# EAGLE design BlueNRG (EAGLE 9.3.0)
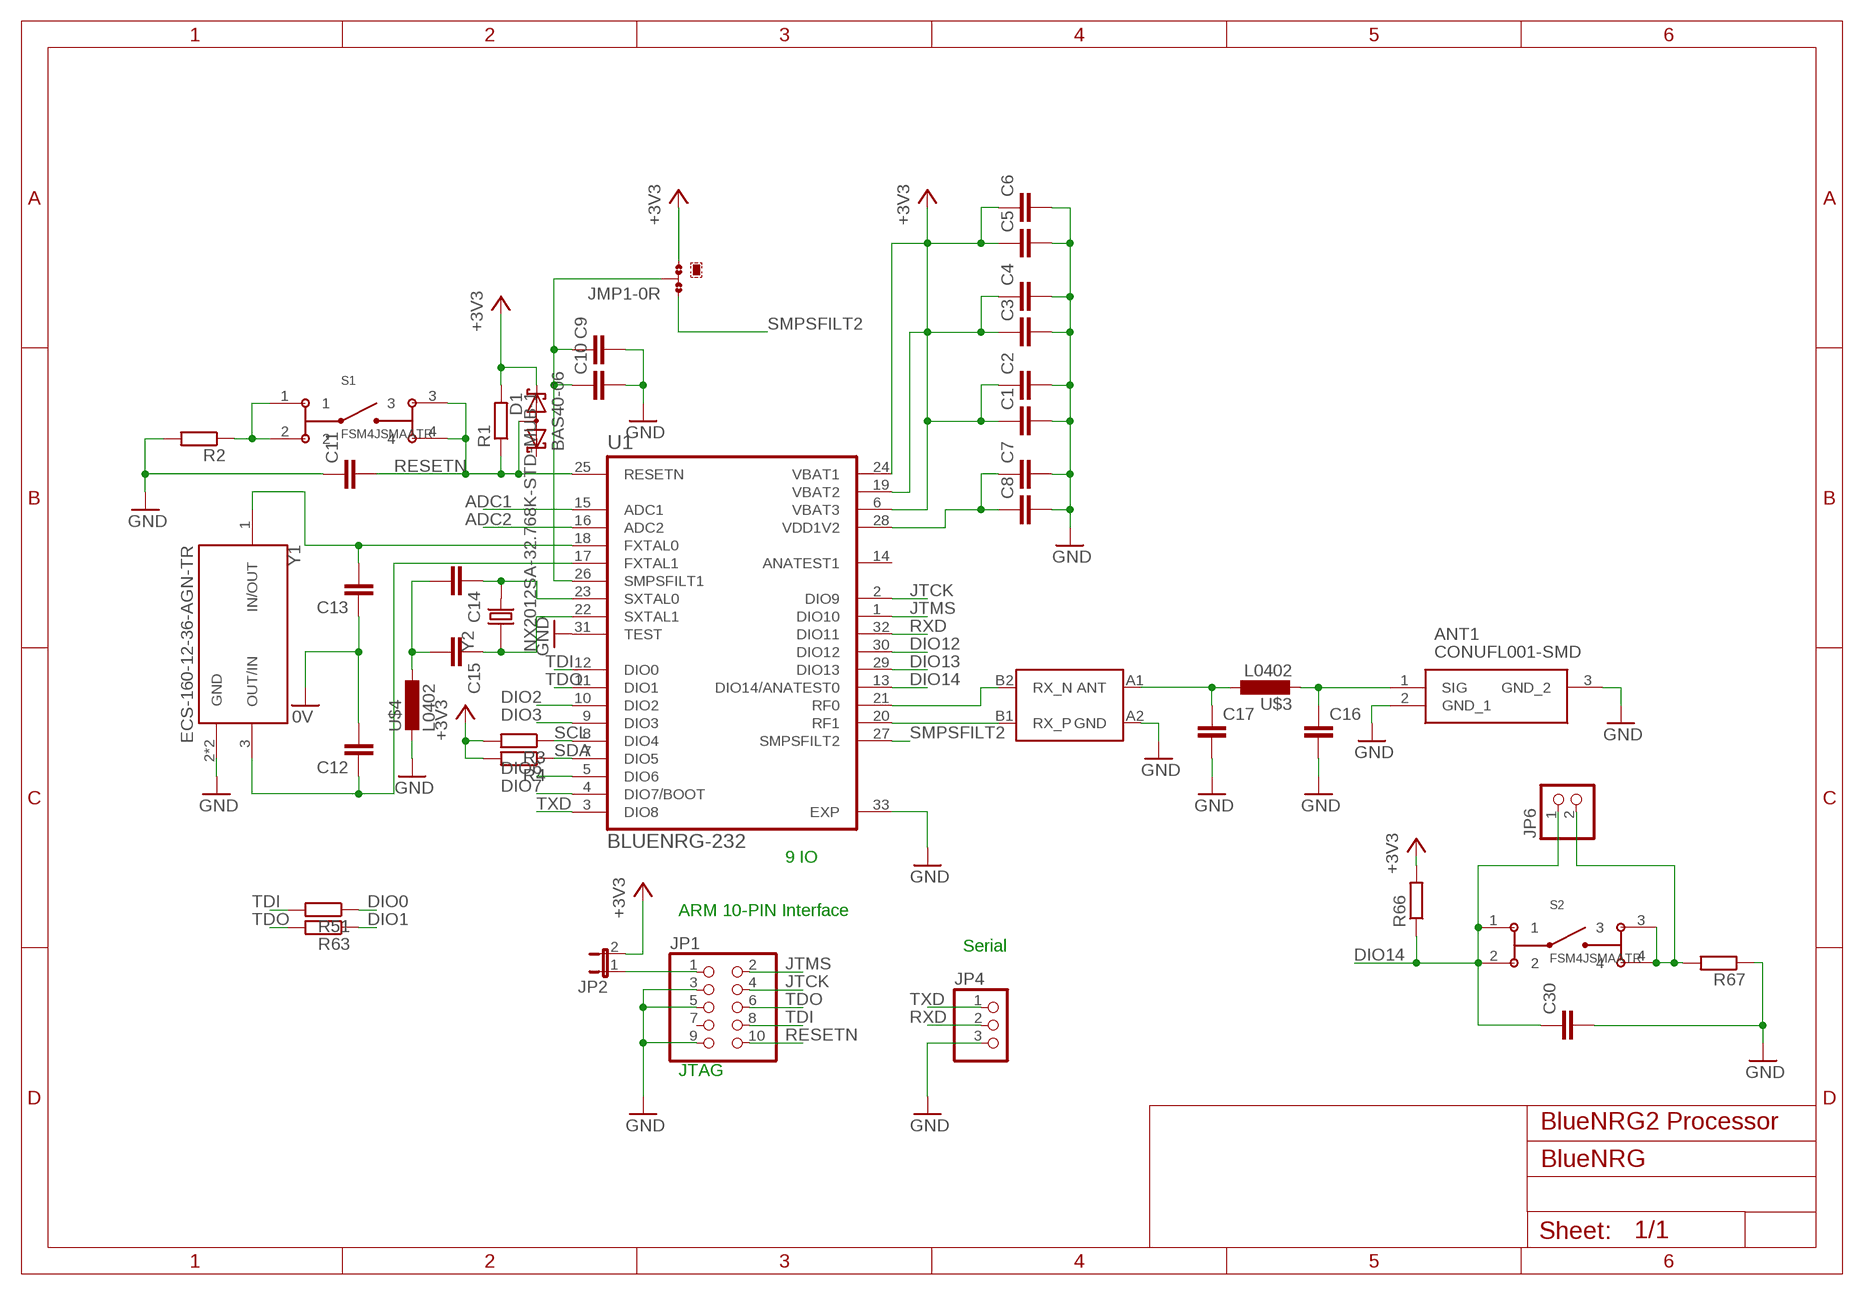
[diagram p0: schematic, sheet 1]

## Parts
ANT1  CONUFL001-SMD  [CONUFL001-SMD]
C1  C-EUC0805K  [C0805K]
C2  C-EUC0805K  [C0805K]
C3  C-EUC0805K  [C0805K]
C4  C-EUC0805K  [C0805K]
C5  C-EUC0805K  [C0805K]
C6  C-EUC0805K  [C0805K]
C7  C-EUC0805K  [C0805K]
C8  C-EUC0805K  [C0805K]
C9  C-EUC0805K  [C0805K]
C10  C-EUC0805K  [C0805K]
C11  C-EUC0805  [C0805]
C12  C-EUC0805  [C0805]
C13  C-EUC0805  [C0805]
C14  C-EUC0805  [C0805]
C15  C-EUC0805  [C0805]
C16  C-EUC0402  [C0402]
C17  C-EUC0402  [C0402]
C30  C-EUC0805  [C0805]
D1  BAS40-06  [SOT23]
JMP1  0R-JUMPA  [A0R-JMP]
JP1  PINHD-2X5  [2X05]
JP2  JP1E  [JP1]
JP4  PINHD-1X3  [1X03]
JP6  PINHD-1X2  [1X02]
R1  R-EU_R0805  [R0805]
R2  R-EU_R0805  [R0805]
R3  R-EU_R0805  [R0805]
R4  R-EU_R0805  [R0805]
R51  R-EU_R0805  [R0805]
R63  R-EU_R0805  [R0805]
R66  R-EU_R1210  [R1210]
R67  R-EU_R1210  [R1210]
S1  FSM4JSMAATR  [SW_FSM4JSMAATR]
S2  FSM4JSMAATR  [SW_FSM4JSMAATR]
U1  BLUENRG-232  [QFN50P500X500X100-33T345N]
U$3  L0402  [R0402]
U$4  L0402  [R0402]
U$5  BALF-NRG-01D3  [FLIPCHIP]
Y1  ECS-160-12-36-AGN-TR  [XTAL_ECS-160-12-36-AGN-TR]
Y2  NX2012SA-32.768K-STD-MUB-1  [XTAL_NX2012SA-32.768K-STD-MUB-1]

## Nets
0V: C12.2 C13.1
+3V3: C1.1 C2.1 C3.1 C4.1 C5.1 C6.1 D1.2(K2) JMP1.3 JP2.2 R1.2 R3.2 R4.2 R66.2 U1.6(VBAT3) U1.19(VBAT2) U1.24(VBAT1)
ADC1: U1.15(ADC1)
ADC2: U1.16(ADC2)
DIO0: R51.1
DIO1: R63.1
DIO2: U1.10(DIO2)
DIO3: U1.9(DIO3)
DIO6: U1.5(DIO6)
DIO7: U1.4(DIO7/BOOT)
DIO12: U1.30(DIO12)
DIO13: U1.29(DIO13)
DIO14: C30.1 JP6.1 R66.1 S2.1 S2.2 U1.13(DIO14/ANATEST0)
GND: ANT1.2(GND_1) ANT1.3(GND_2) C1.2 C2.2 C3.2 C4.2 C5.2 C6.2 C7.2 C8.2 C9.2 C10.2 C11.1 C16.2 C17.2 C30.2 JP1.3 JP1.5 JP1.9 JP4.3 R2.2 R67.1 U1.31(TEST) U1.33(EXP) U$4.2 U$5.A2(GND) Y1.2(GND) Y1.4(GND)
JTCK: JP1.4 U1.2(DIO9)
JTMS: JP1.2 U1.1(DIO10)
N$1: C7.1 C8.1 U1.28(VDD1V2)
N$2: C9.1 C10.1 JMP1.2 U1.26(SMPSFILT1)
N$3: JP1.1 JP2.1
N$4: C12.1 U1.17(FXTAL1) Y1.3(OUT/IN)
N$5: R2.1 S1.1 S1.2
N$6: C13.2 U1.18(FXTAL0) Y1.1(IN/OUT)
N$7: U1.21(RF0) U$5.B2(RX_N)
N$8: U1.20(RF1) U$5.B1(RX_P)
N$9: C14.2 C15.2 U$4.1
N$10: C14.1 U1.23(SXTAL0) Y2.2
N$11: C15.1 U1.22(SXTAL1) Y2.1
N$16: C17.1 U$3.1 U$5.A1(ANT)
N$17: ANT1.1(SIG) C16.1 U$3.2
N$114: JP6.2 R67.2 S2.3 S2.4
RESETN: C11.2 D1.3(AA) JP1.10 R1.1 S1.3 S1.4 U1.25(RESETN)
RXD: JP4.2 U1.32(DIO11)
SCL: R3.1 U1.8(DIO4)
SDA: R4.1 U1.7(DIO5)
SMPSFILT2: JMP1.1 U1.27(SMPSFILT2)
TDI: JP1.8 R51.2 U1.12(DIO0)
TDO: JP1.6 R63.2 U1.11(DIO1)
TXD: JP4.1 U1.3(DIO8)
Unconnected: D1.1(K1) JP1.7 U1.14(ANATEST1)

## Notes on the sheet
- 9 IO
- ARM 10-PIN Interface
- Serial
- JTAG
- BlueNRG2 Processor

## Library data of the parts
ANT1 = BlueHome:CONUFL001-SMD: RF Connectors / Coaxial Connectors U.FL Straight Surface Mount Jack Source: Datasheet <https://componentsearchengine.com/Datasheets/1/CONUFL001-SMD.pdf>; DESCRIPTION: RF Connectors / Coaxial Connectors U.FL Straight Surface Mount Jack; HEIGHT: mm; MANUFACTURER_NAME: Linx Technologies; MANUFACTURER_PART_NUMBER: CONUFL001-SMD; MOUSER_PART_NUMBER: 712-CONUFL001-SMD
C1-C17 C30 = rcl:C-EU: CAPACITOR, European symbol
D1 = diode:BAS40-06: Silicon Schottky Diodes General-purpose diode for high-speed switching
JMP1 = jump-0r-smd:0R-JUMP: SMD 0R 0805 Jumper
JP1 = pinhead:PINHD-2X5: PIN HEADER
JP2 = jumper:JP1E: JUMPER
JP4 = pinhead:PINHD-1X3: PIN HEADER
JP6 = pinhead:PINHD-1X2: PIN HEADER
R1-R4 R51 R63 R66 R67 = rcl:R-EU_: RESISTOR, European symbol
S1 S2 = BlueHome:FSM4JSMAATR: Switch Tactile OFF (ON) SPST Round Button Gull Wing 0.05A 24VDC 2.6N SMD T/R; AVAILABILITY: Unavailable; DESCRIPTION: Switch Tactile OFF _ON_ SPST Round Button Gull Wing 0.05A 24VDC 2.6N SMD T/R; MF: TE Connectivity; MP: FSM4JSMAATR; PACKAGE: None; PRICE: None; TE_PURCHASE_URL: https://www.te.com/usa-en/product-FSM4JSMAATR.html?te_bu=Cor&te_type=disp&te_campaign=seda_glo_cor-seda-global-disp-prtnr-fy19-seda-model-bom-cta_sma-317_1&elqCampaignId=32493
U1 = BlueHome:BLUENRG-232: Bluetooth Low Energy Wireless Soc; AVAILABILITY: Unavailable; DESCRIPTION: Bluetooth Low Energy Wireless Soc; MF: STMicroelectronics; MP: BLUENRG-232; PACKAGE: VFQFN-32 STMicroelectronics; PRICE: None
U$3 U$4 = BlueHome:L
U$5 = BlueHome:BALF-NRG-01D3; AVAILABILITY: Unavailable; DESCRIPTION: 50 Ω nominal input / conjugate match balun to BlueNRG transceiver, with integrated harmonic filter; MF: STMicroelectronics; MP: BALF-NRG-01D3; PACKAGE: WFBGA-4 STMicroelectronics; PRICE: None
Y1 = BlueHome:ECS-160-12-36-AGN-TR: The minature ECX-2236 is a compact SMD Crystal. The industry standard 2.5 x 2.0 x 0.55 mm ceramic package is ideal for today’s SMD manufacturing environment.; AVAILABILITY: Unavailable; DESCRIPTION: Crystal 16MHz ±25ppm _Tol_ ±30ppm _Stability_ 12pF FUND 80Ohm 4-Pin Mini-CSMD T/R; MF: ECS Inc.; MP: ECS-160-12-36-AGN-TR; PACKAGE: SMD-4 ECS International; PRICE: None
Y2 = BlueHome:NX2012SA-32.768K-STD-MUB-1: Crystal 32.7680khz 12.5pf Smd; AVAILABILITY: Unavailable; DESCRIPTION: Crystal 32.7680khz 12.5pf Smd; MF: NDK America,; MP: NX2012SA-32.768K-STD-MUB-1; PACKAGE: SMD-2 NDK; PRICE: None

## Board
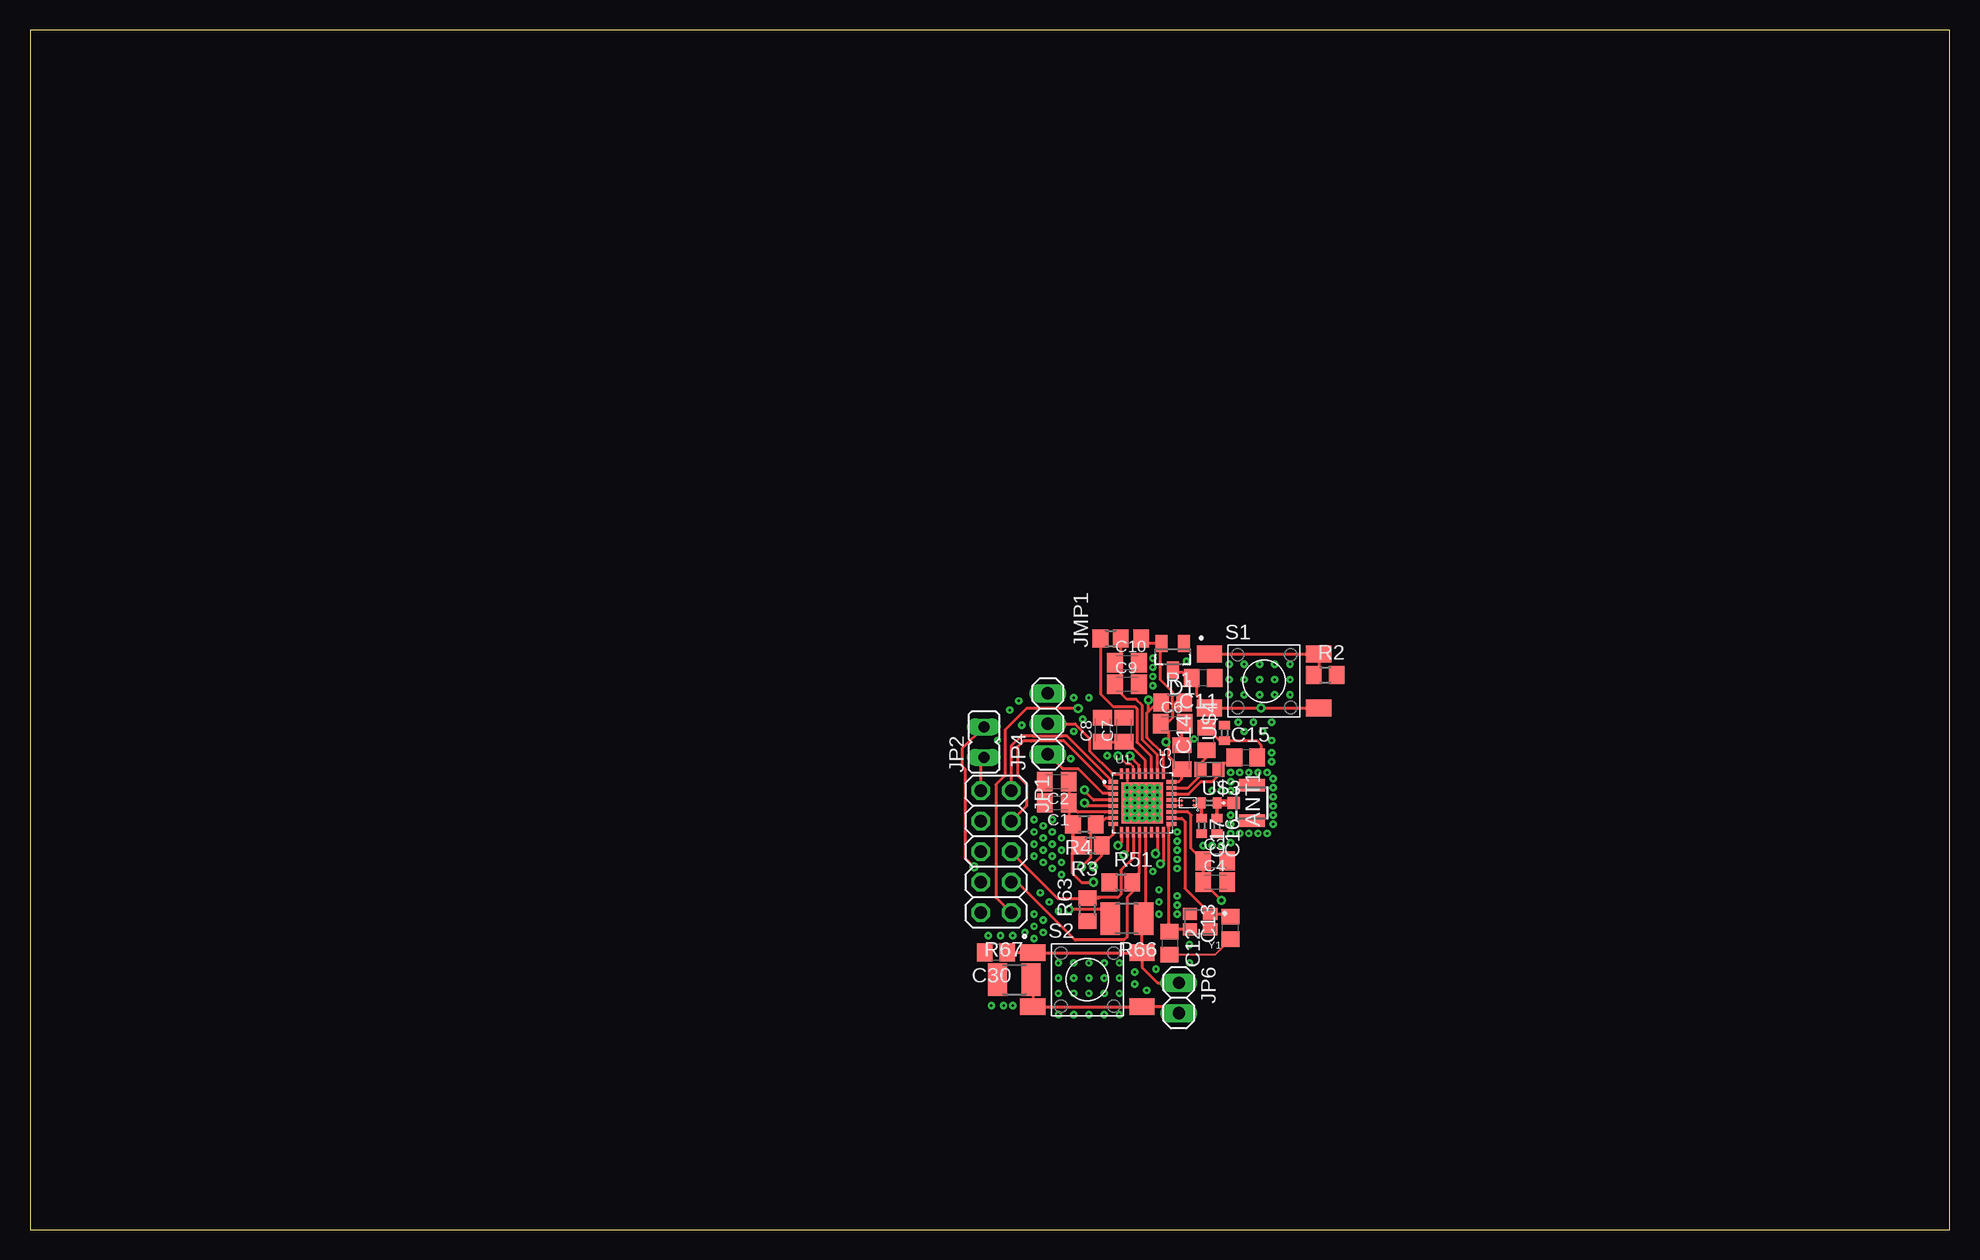
[diagram p1: board, top side]
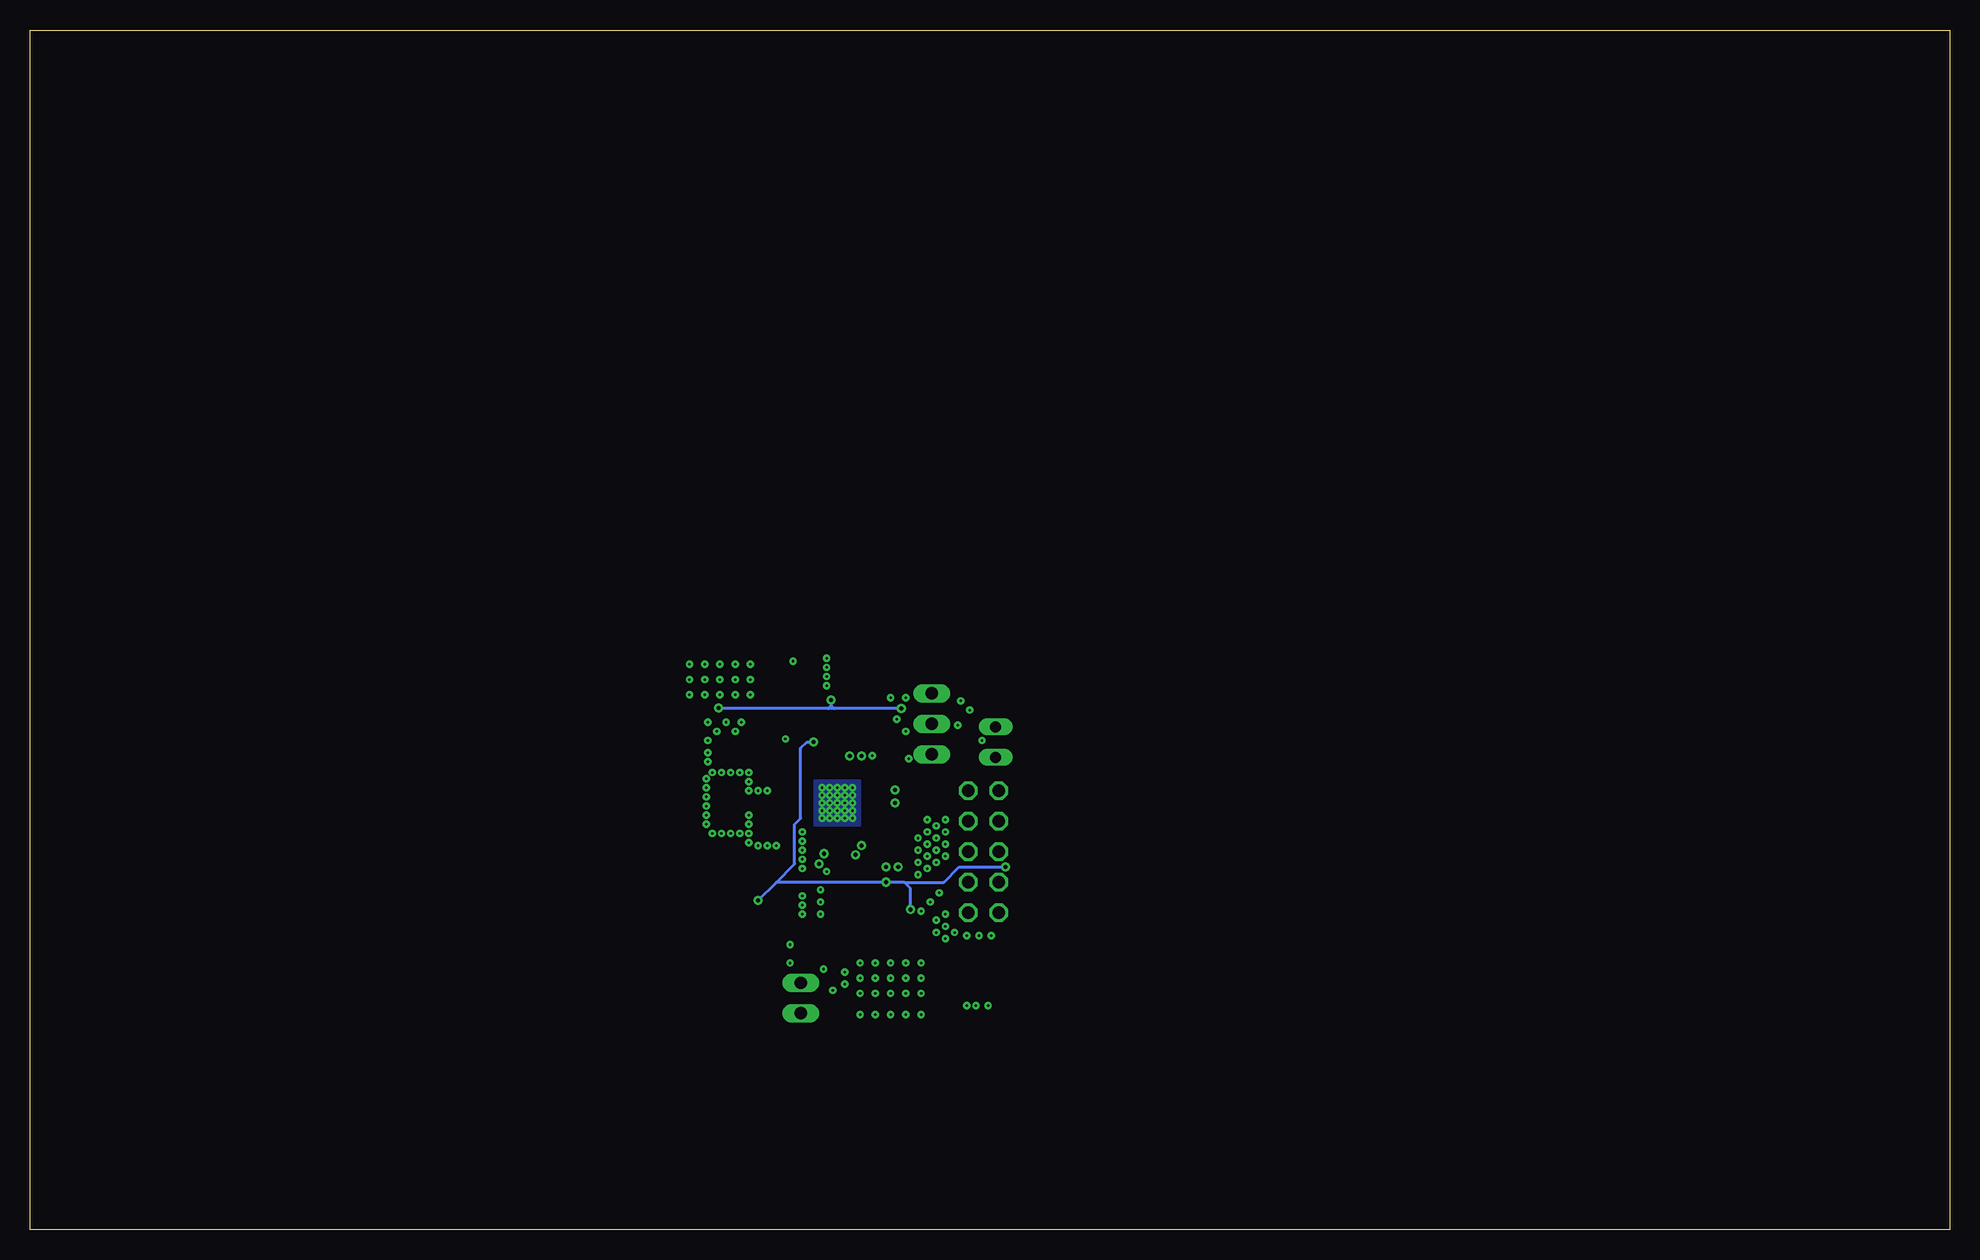
[diagram p2: board, bottom side, seen from below]

Size 160 x 100 mm. Coordinates in mm from the lower left corner, seen from the top.
Outline: 0,0 160,0 160,100 0,100 0,0
Copper layers (1*16): Top 0.035mm / dielectric 1.5mm / Bottom 0.035mm
Design rules "default": minimum track width 6mil, minimum drill 0.35mm, track to track 6mil, track to pad 6mil, pad to pad 6mil, via to via 6mil, smd to smd 6mil, copper to edge 40mil, drill to drill 6mil, minimum pad ring 10mil, minimum via ring 8mil, stop-mask expansion 4mil, vias tented up to drill 0mil, thermal gap 10mil

### Footprints (pad centres in the part's own frame; a part is rotated, then mirrored left to right if it is on the bottom)
CONUFL001-SMD = smd 1 x 1.05: 1 0,-1.525 | smd 1.05 x 2.2: 2 -1.475,0; 3 1.475,0
C0805K = smd 1.3 x 1.6: 1 -1,0; 2 1,0
C0805 = smd 1.3 x 1.5: 1 -0.95,0; 2 0.95,0
C0402 = smd 0.7 x 0.9: 1 -0.65,0; 2 0.65,0
SOT23 = smd 1 x 1.4: 1 -0.95,-1.1; 2 0.95,-1.1; 3 0,1.1
A0R-JMP = smd 1.5 x 1.3: 1 0,1.7; 2 0,0; 3 0,-1.7
2X05 = drill 1.016 octagon: 1 -5.08,-1.27; 2 -5.08,1.27; 3 -2.54,-1.27; 4 -2.54,1.27; 5 0,-1.27; 6 0,1.27; 7 2.54,-1.27; 8 2.54,1.27; 9 5.08,-1.27; 10 5.08,1.27
JP1 = drill 0.914 long: 1 0,-1.27; 2 0,1.27
1X03 = drill 1.016 long: 1 -2.54,0; 2 0,0; 3 2.54,0
1X02 = drill 1.016 long: 1 -1.27,0; 2 1.27,0
R0805 = smd 1.3 x 1.5: 1 -0.95,0; 2 0.95,0
R1210 = smd 1.6 x 2.7: 1 -1.4,0; 2 1.4,0
SW_FSM4JSMAATR = smd 2.1 x 1.4: 1 -4.55,2.25; 2 4.55,2.25; 3 -4.55,-2.25; 4 4.55,-2.25
QFN50P500X500X100-33T345N = smd 0.84 x 0.29: 1 -2.435,1.75; 2 -2.435,1.25; 3 -2.435,0.75; 4 -2.435,0.25; 5 -2.435,-0.25; 6 -2.435,-0.75; 7 -2.435,-1.25; 8 -2.435,-1.75; 17 2.435,-1.75; 18 2.435,-1.25; 19 2.435,-0.75; 20 2.435,-0.25; 21 2.435,0.25; 22 2.435,0.75; 23 2.435,1.25; 24 2.435,1.75 | smd 0.29 x 0.84: 9 -1.75,-2.435; 10 -1.25,-2.435; 11 -0.75,-2.435; 12 -0.25,-2.435; 13 0.25,-2.435; 14 0.75,-2.435; 15 1.25,-2.435; 16 1.75,-2.435; 25 1.75,2.435; 26 1.25,2.435; 27 0.75,2.435; 28 0.25,2.435; 29 -0.25,2.435; 30 -0.75,2.435; 31 -1.25,2.435; 32 -1.75,2.435 | smd 3.45 x 3.45: 33 0,0
R0402 = smd 0.7 x 0.9: 1 -0.65,0; 2 0.65,0
FLIPCHIP = smd 0.255 x 0.255: A1 -0.5,0.2; A2 -0.5,-0.2; B1 0.5,0.2; B2 0.5,-0.2
XTAL_ECS-160-12-36-AGN-TR = smd 1.2 x 1: 1 -0.85,-0.65; 2 0.85,-0.65; 3 0.85,0.65; 4 -0.85,0.65
XTAL_NX2012SA-32.768K-STD-MUB-1 = smd 1 x 1.25: 1 -0.75,0; 2 0.75,0

### Placement (x,y rotation side)
ANT1  101.85,35.56 270 top
C1  85.6,35.56 180 top
C2  85.6,37.34 180 top
C3  98.81,30.73 0 top
C4  98.81,28.96 0 top
C5  96.01,39.37 90 top
C6  95.25,42.16 0 top
C7  91.19,41.66 90 top
C8  89.41,41.66 90 top
C9  91.44,45.47 0 top
C10  91.44,47.24 0 top
C11  97.79,45.97 180 top
C12  95,23.88 270 top
C13  100.08,25.15 90 top
C14  98.04,40.89 90 top
C15  101.35,39.37 0 top
C16  98.93,33.66 270 top
C17  97.66,33.66 270 top
C30  80.52,23.11 180 top
D1  95.25,47.75 180 top
JMP1  90.93,49.28 90 top
JP1  80.52,31.5 270 top
JP2  79.5,40.64 0 top
JP4  84.84,42.16 90 top
JP6  95.76,19.3 270 top
R1  95.25,43.94 0 top
R2  107.95,46.23 0 top
R3  88.39,32 180 top
R4  87.88,33.78 180 top
R51  90.93,28.96 0 top
R63  88.14,26.67 90 top
R66  91.44,25.91 180 top
R67  82.04,20.83 0 top
S1  102.87,45.72 0 top
S2  88.14,20.83 0 top
U1  92.71,35.56 0 top
U$3  98.3,35.56 0 top
U$4  99.57,41.4 90 top
U$5  96.52,35.56 180 top
Y1  97.54,25.65 180 top
Y2  98.3,38.35 180 top

### Tracks (layer width: path | path; a pad name or v marks a point on that pad's centre or on a via)
0V
  Top 0.152: C13.1 98.81,22.93 C12.2
+3V3  (via drill 0.35 pad 0.2)
  Top 0.254: U1.19 96.51,34.81 96.77,34.54 96.77,31.77 C3.1 C4.1 99.31,27.45 v99.31,27.43 | U1.24 95.17,37.34 95.76,37.34 96.01,37.59 C5.1 96,38.37 94.93,39.43 94.93,40.64 | 94.93,40.64 94.93,41.48 C6.1 94.74,42.16 95.25,42.67 95.25,43.69 | 95.25,43.69 95.5,43.94 R1.2 | D1.2 94.23,48.85 | 94.23,48.85 93.06,48.85 JMP1.3 | U1.6 89.6,34.81 87.35,34.81 C1.1 C2.1 86.6,33.86 86.93,33.53 | v94.68,40.64 94.93,40.64 | R3.2 86.87,31.43 86.87,29.72 87.63,28.96 v88.65,28.96 | R66.2 89.28,26.67 v86.61,26.67 | JP2.2 77.72,40.13 77.72,38.61 77.98,38.35 77.98,30.94 v78.69,30.23 | 95.25,43.69 95.23,43.71 95.23,44.81 94.23,45.8 94.23,48.85
  Top 0.305: R4.2 86.93,33.53 86.93,32.51 R3.2
  Bottom 0.254: v99.31,27.43 97.79,28.96 | v94.68,40.64 95.25,40.64 95.76,40.13 95.76,34.29 96.27,33.78 96.27,30.48 97.79,28.96 | 97.79,28.96 v88.65,28.96 87.12,28.96 | v86.61,26.67 86.61,28.45 87.12,28.96 | 87.12,28.96 83.82,28.96 82.55,30.23 v78.69,30.23
ADC1  (via drill 0.35 pad 0.2)
  Top 0.254: U1.15 93.96,31.49 v93.8,31.33
ADC2  (via drill 0.35 pad 0.2)
  Top 0.254: U1.16 94.46,30.71 v94.23,30.48
DIO2  (via drill 0.35 pad 0.2)
  Top 0.254: U1.10 91.46,31.52 v91.19,31.24
DIO3  (via drill 0.35 pad 0.2)
  Top 0.254: U1.9 90.96,32.29 v90.68,32
DIO6  (via drill 0.35 pad 0.2)
  Top 0.254: U1.5 88.13,35.31 v87.88,35.56
DIO7  (via drill 0.35 pad 0.2)
  Top 0.254: U1.4 88.65,35.81 87.82,36.64 v87.88,36.64
DIO12  (via drill 0.35 pad 0.2)
  Top 0.203: 91.95,38.01 91.95,38.61 91.74,38.82 91.4,38.82 90.75,39.48 v90.68,39.48
  Top 0.254: U1.30 91.95,38.01
DIO13  (via drill 0.35 pad 0.2)
  Top 0.254: U1.29 92.46,38.69 v91.67,39.48
DIO14
  Top 0.254: U1.13 92.96,26.8 93.03,26.73 93.03,25.97 92.96,25.91 R66.1 92.69,25.76 S2.2 | C30.1 81.5,23.08 | 81.5,23.08 81.79,22.79 | 81.5,23.08 S2.1 S2.2 | S2.2 92.69,21.87 93.98,20.57 JP6.1
GND  (via drill 0.2 pad 0.2)
  Top 0.203: U1.31 91.46,36.85 v91.44,36.83 | C5.2 96.5,40.37 v97.03,40.89
  Top 0.254: C5.2 96.01,41.93 C6.2
  other vias: 92.08,36.83 92.71,36.83 93.34,36.83 93.98,36.83 91.44,36.2 92.08,36.2 92.71,36.2 93.34,36.2 93.98,36.2 91.44,35.56 92.08,35.56 92.71,35.56 93.34,35.56 93.98,35.56 91.44,34.92 92.08,34.92 92.71,34.92 93.34,34.92 93.98,34.92 91.44,34.29 92.08,34.29 92.71,34.29 93.34,34.29 93.98,34.29 100.08,36.58 99.31,36.58 98.55,36.58 100.08,37.34 100.08,34.54 100.08,33.78 100.84,33.02 100.08,33.02 101.6,33.02 102.36,33.02 103.12,33.02 103.63,34.54 103.63,33.78 103.63,35.31 103.63,36.07 103.63,36.83 103.63,37.59 103.12,38.1 102.36,38.1 101.6,38.1 100.84,38.1 100.08,38.1 100.08,32.26 99.31,32 98.55,32 97.79,32 95.63,33.15 95.63,32.38 95.63,31.62 95.63,30.86 95.63,30.1 95.63,27.81 95.63,27.05 95.63,26.29 83.69,34.16 83.69,33.15 83.69,32.13 83.69,31.11 84.45,33.66 84.45,32.64 84.45,31.62 84.45,30.61 85.22,31.11 85.22,32.13 85.22,33.15 85.22,34.16 85.98,32.64 85.98,31.62 85.98,30.61 85.22,30.1 85.98,29.59 84.2,28.07 84.96,27.3 85.72,26.54 83.69,26.29 83.69,25.27 84.45,25.78 84.45,24.77 83.69,24.26 82.93,24.77 81.92,24.51 80.9,24.51 79.88,24.51 85.72,22.23 85.72,20.95 85.72,19.68 87,19.68 88.27,19.68 90.81,19.68 89.53,19.68 87,20.95 87,22.23 88.27,22.23 89.53,22.23 88.27,20.95 89.53,20.95 90.81,20.95 90.81,22.23 92.08,21.46 92.08,20.45 93.09,19.94 94.11,26.29 94.11,27.3 94.11,28.32 93.6,29.84 96.65,23.75 96.65,22.23 93.85,21.72 85.72,17.91 87,17.91 88.27,17.91 89.53,17.91 90.81,17.91 86.74,39.24 87,41.53 89.79,39.5 87.76,42.55 82.68,42.04 80.64,40.77 81.66,43.31 82.42,44.07 87,44.32 88.27,44.32 93.6,45.34 93.6,46.86 93.6,46.1 93.6,47.62 96.39,47.37 99.95,47.12 99.95,45.85 99.95,44.58 101.22,44.58 102.49,44.58 103.76,44.58 105.03,44.58 105.03,45.85 105.03,47.12 103.76,47.12 102.49,47.12 101.22,47.12 101.22,45.85 102.49,45.85 103.76,45.85 100.71,42.29 101.22,41.53 101.98,42.29 102.74,41.53 103.5,42.29 103.5,40.77 103.5,39.75 103.5,38.99 80.14,18.67 81.15,18.67 81.92,18.67
  pour Bottom: 90.81,37.47 90.81,33.66 94.61,33.66 94.61,37.47
JTCK
  Top 0.254: 89.83,36.81 U1.2 90.2,36.89 89.75,36.89 89.58,37.06 89.58,37.34 86.2,40.72 83.47,40.72 83.45,40.74 82.8,40.74 82.3,40.23 82.3,37.85 83.06,37.08 83.06,35.31 JP1.4
JTMS
  Top 0.254: U1.1 86.44,41.15 86.06,41.15 86.03,41.12 83.64,41.12 83.62,41.15 82.64,41.15 81.79,40.3 JP1.2
N$1
  Top 0.254: C8.1 C7.1 91.42,40.66 92.96,39.12 U1.28
N$2
  Top 0.254: U1.26 93.96,39.58 92.71,40.83 92.71,43.69 92.2,44.2 91.44,44.2 90.93,44.7 90.93,45.47 | 90.93,45.47 90.93,47.24 | 90.93,47.24 JMP1.2 | C10.1 90.93,47.24 | C9.1 90.93,45.47
N$3
  Top 0.254: JP2.1 79.25,39.12 JP1.1
N$4
  Top 0.254: 96.54,25.15 Y1.3 94.89,25 | U1.17 94.89,33.56 94.89,25 | 94.89,25 94.89,24.93 C12.1
N$5
  Top 0.254: S1.1 S1.2 107.42,46.65 R2.1
N$6
  Top 0.254: U1.18 95.17,34.29 96.01,34.29 96.27,34.04 96.27,28.45 98.39,26.33 Y1.1 100.08,26.3 C13.2
N$7
  Top 0.152: U1.21 95.19,35.76 U$5.B2
N$8
  Top 0.152: U1.20 95.19,35.36 U$5.B1
N$9
  Top 0.254: C15.2 102.62,39.69 102.62,40.39 102.25,40.75 U$4.1 99.14,40.75 C14.2
N$10
  Top 0.254: U1.23 96.5,36.81 97.55,37.86 Y2.2 97.55,38.87 98.04,39.37 C14.1
N$11
  Top 0.254: 95.16,36.32 U1.22 96.58,36.31 97.6,37.34 98.55,37.34 99.05,37.83 Y2.1 99.05,38.85 99.06,38.86 99.89,38.86 C15.1
N$16
  Top 0.254: U$5.A1 97.28,35.36 | 97.28,35.36 97.61,35.36 97.66,35.31 | U$3.1 97.48,35.56 97.28,35.36
  Top 0.305: U$3.1 97.66,35.55 97.66,35.31 C17.1
N$17
  Top 0.305: U$3.2 98.95,34.32 C16.1
  Top 0.61: U$3.2 ANT1.1
N$114
  Top 0.254: R67.2 83.59,20.68 S2.3 S2.4 95.21,18.58 JP6.2
RESETN  (via drill 0.35 pad 0.2)
  Top 0.254: S1.4 v102.62,43.47 S1.3 97.28,44.51 97.28,45.53 C11.2 96.52,45.97 96.05,46.44 95.04,46.44 D1.3 | R1.1 93.98,43.94 93.22,43.18 | 93.22,43.18 93.12,43.09 93.12,40.99 94.46,39.65 U1.25 | JP1.10 80.52,27.69 80.52,37.08 81.28,37.85 81.28,41.66 83.06,43.43 v87.38,43.43 | 93.22,43.18 v93.22,44.13
  Bottom 0.254: v87.38,43.43 92.96,43.43 | 92.96,43.43 93.47,43.43 | 93.47,43.43 102.58,43.43 v102.62,43.47 | 93.22,43.69 93.47,43.43 | v93.22,44.13 93.22,43.69 | 93.22,43.69 92.96,43.43
RXD
  Top 0.254: U1.32 90.17,37.99 90.17,38.05 88.33,39.89 88.33,40.96 87.12,42.16 JP4.2
SCL  (via drill 0.35 pad 0.2)
  Top 0.254: R3.1 89.85,32.51 | U1.8 90.28,32.94 R3.1 | v88.65,30.23 88.65,30.48 89.34,31.18 R3.1
SDA  (via drill 0.35 pad 0.2)
  Top 0.254: U1.7 89.68,34.31 89.15,33.78 R4.1 88.83,33.46 88.39,33.02 88.39,30.99 v87.63,30.23
SMPSFILT2
  Top 0.254: 93.46,38.44 U1.27 93.46,39.45 92.27,40.64 92.27,43.42 92.1,43.59 90.27,43.59 89.23,44.63 JMP1.1
TDI
  Top 0.254: U1.12 92.46,29.72 R51.2 91.88,28.13 91.44,27.69 91.44,24.38 91.19,24.13 87.12,24.13 82.3,28.96 JP1.8
TDO
  Top 0.254: U1.11 91.96,31 90.93,29.97 90.93,27.94 90.68,27.69 89.15,27.69 | 89.15,27.69 88.9,27.69 | JP1.6 85.66,27.62 R63.2 89.09,27.62 89.15,27.69
TXD
  Top 0.254: 90.26,36.32 U1.3 90.2,36.39 89.41,36.39 87.4,38.38 87.36,38.42 86.04,38.42 JP4.1